# EAGLE schematic bc-module-base (EAGLE 7.7.0)
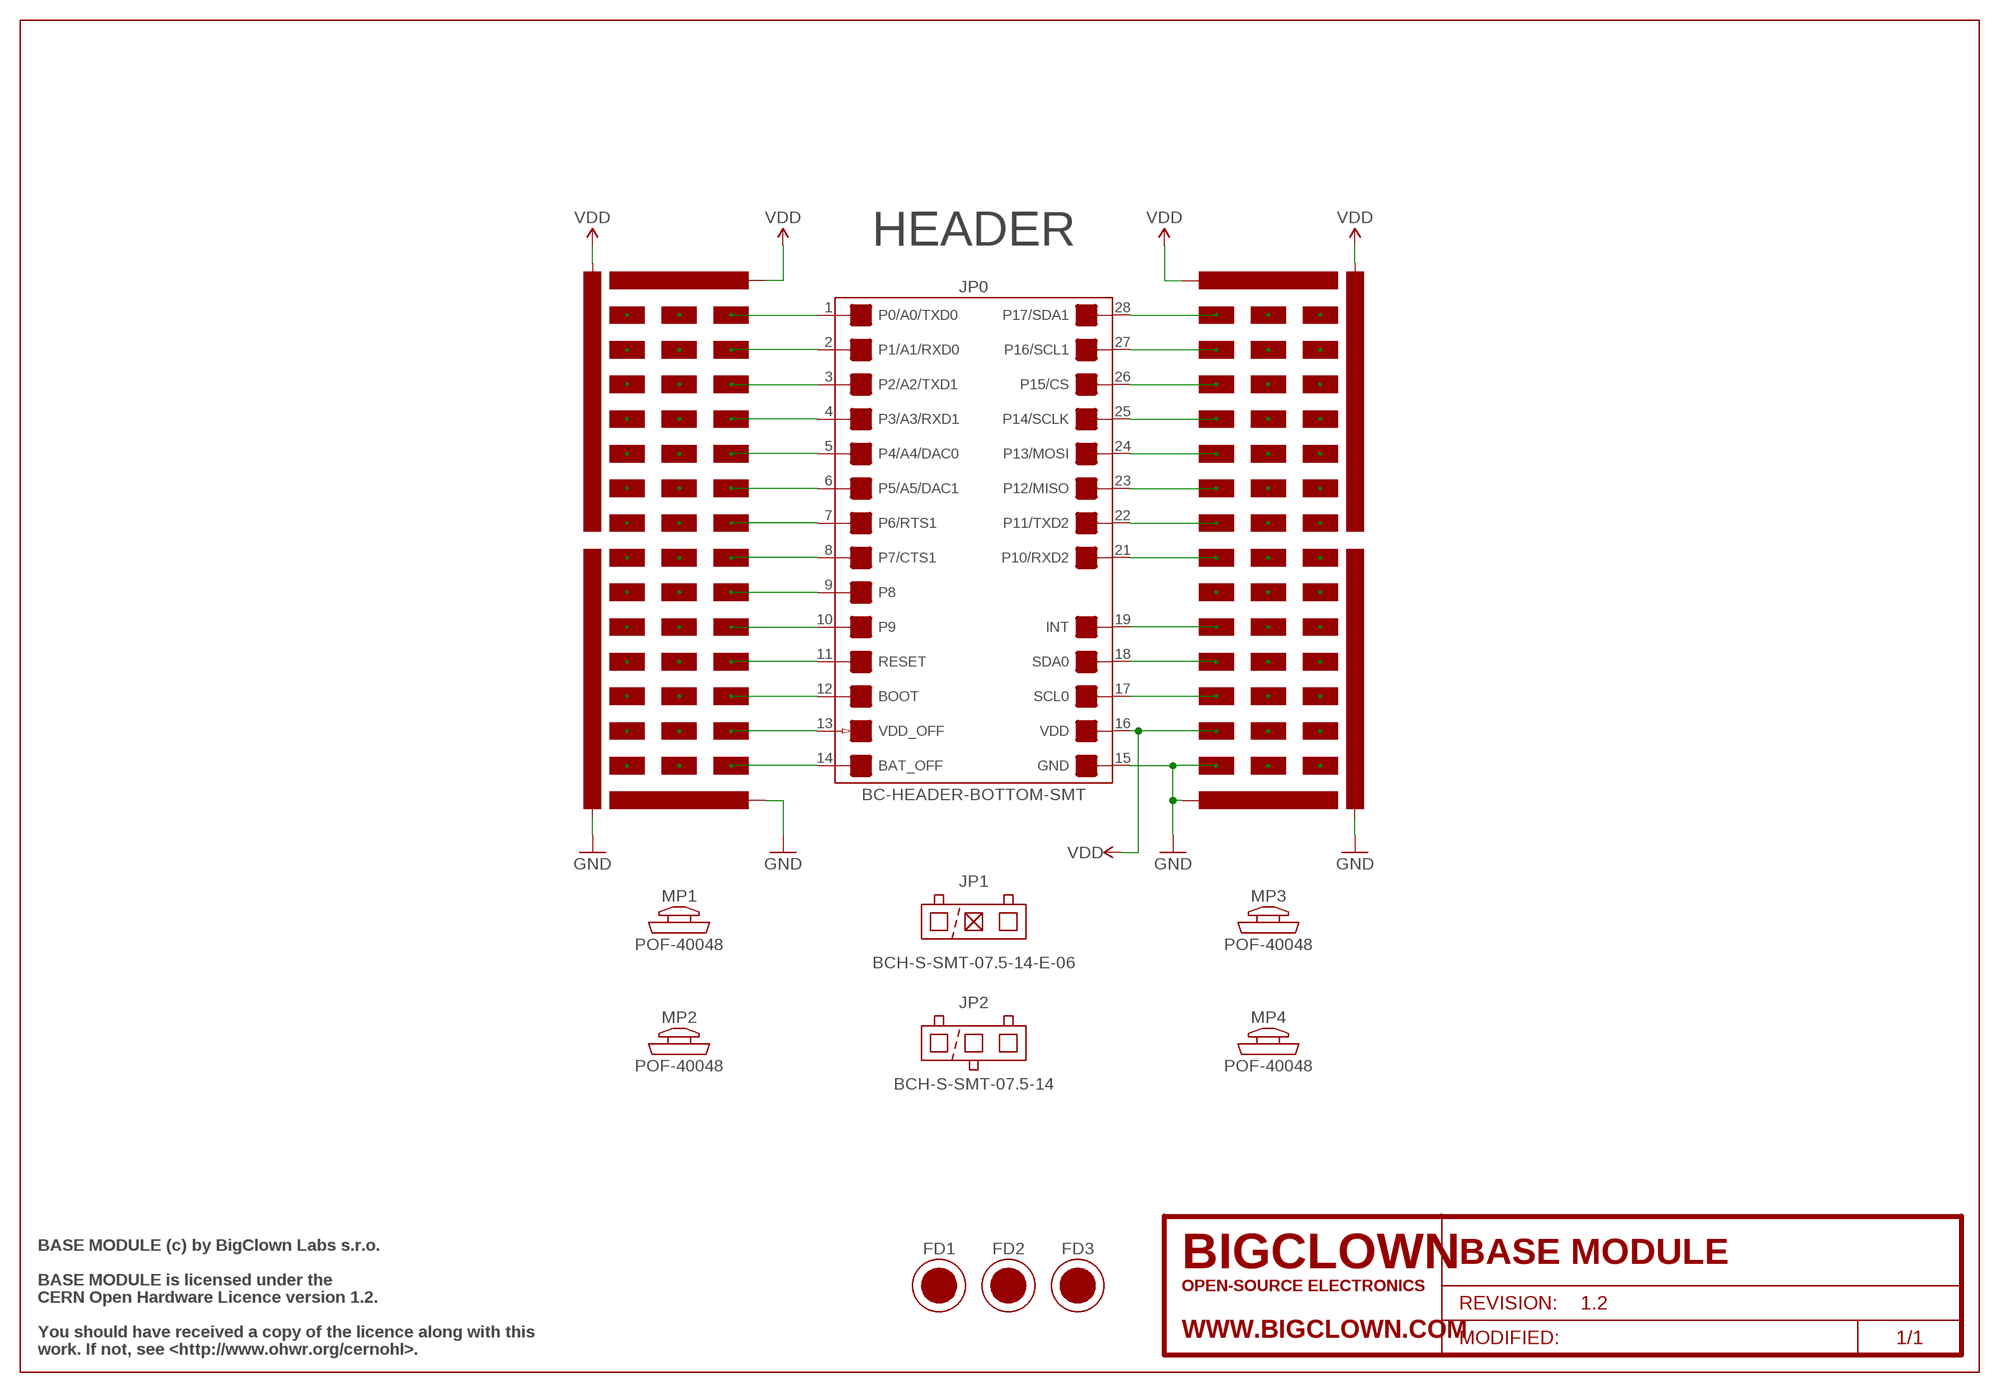
[diagram p0: schematic, sheet 1]

## Parts
FD1  FIDUCIAL  [FIDUCIAL-1MM]
FD2  FIDUCIAL  [FIDUCIAL-1MM]
FD3  FIDUCIAL  [FIDUCIAL-1MM]
FRAME1  FRAME-SCH/A4L-BRD/A4L  [FRAME-A4L]
JP0  BC-HEADER-BOTTOM-SMT  [BC-HEADER-BOTTOM-SMT]
JP1  BCH-S-SMT-07.5-14-E-06  JP-BCH-S-SMT-07.5-14-E-06  [BCH-S-SMT-14-E-06]
JP2  BCH-S-SMT-07.5-14  JP-BCH-S-SMT-07.5-14  [BCH-S-SMT-14]
JS1  PAD-SMD-1.6X14.30MM  [PAD-SMD-1.6X14.30MM]
JS1A  PAD-SMD-1.6X4.14MM  [PAD-SMD-1.6X4.14MM]
JS1B  PAD-SMD-1.6X4.14MM  [PAD-SMD-1.6X4.14MM]
JS1C  PAD-SMD-1.6X4.14MM  [PAD-SMD-1.6X4.14MM]
JS2  PAD-SMD-1.6X19.38  [PAD-SMD-1.6X19.38MM]
JS2A  PAD-SMD-1.6X4.14MM  [PAD-SMD-1.6X4.14MM]
JS2B  PAD-SMD-1.6X4.14MM  [PAD-SMD-1.6X4.14MM]
JS3  PAD-SMD-1.6X19.38  [PAD-SMD-1.6X19.38MM]
JS3A  PAD-SMD-1.6X4.14MM  [PAD-SMD-1.6X4.14MM]
JS3B  PAD-SMD-1.6X4.14MM  [PAD-SMD-1.6X4.14MM]
JS3C  PAD-SMD-1.6X4.14MM  [PAD-SMD-1.6X4.14MM]
JS4  PAD-SMD-1.6X14.30MM  [PAD-SMD-1.6X14.30MM]
JS4A  PAD-SMD-1.6X4.14MM  [PAD-SMD-1.6X4.14MM]
JS4B  PAD-SMD-1.6X4.14MM  [PAD-SMD-1.6X4.14MM]
JS4C  PAD-SMD-1.6X4.14MM  [PAD-SMD-1.6X4.14MM]
JS5  PAD-SMD-1.6X14.30MM  [PAD-SMD-1.6X14.30MM]
JS5C  PAD-SMD-1.6X4.14MM  [PAD-SMD-1.6X4.14MM]
JS5D  PAD-SMD-1.6X4.14MM  [PAD-SMD-1.6X4.14MM]
JS6  PAD-SMD-1.6X19.38  [PAD-SMD-1.6X19.38MM]
JS6A  PAD-SMD-1.6X4.14MM  [PAD-SMD-1.6X4.14MM]
JS6B  PAD-SMD-1.6X4.14MM  [PAD-SMD-1.6X4.14MM]
JS6C  PAD-SMD-1.6X4.14MM  [PAD-SMD-1.6X4.14MM]
JS7  PAD-SMD-1.6X19.38  [PAD-SMD-1.6X19.38MM]
JS7A  PAD-SMD-1.6X4.14MM  [PAD-SMD-1.6X4.14MM]
JS7B  PAD-SMD-1.6X4.14MM  [PAD-SMD-1.6X4.14MM]
JS7C  PAD-SMD-1.6X4.14MM  [PAD-SMD-1.6X4.14MM]
JS8  PAD-SMD-1.6X14.30MM  [PAD-SMD-1.6X14.30MM]
JS8A  PAD-SMD-1.6X4.14MM  [PAD-SMD-1.6X4.14MM]
JS8B  PAD-SMD-1.6X4.14MM  [PAD-SMD-1.6X4.14MM]
JS8C  PAD-SMD-1.6X4.14MM  [PAD-SMD-1.6X4.14MM]
JS8D  PAD-SMD-1.6X4.14MM  [PAD-SMD-1.6X4.14MM]
JS9A  PAD-SMD-1.6X4.14MM  [PAD-SMD-1.6X4.14MM]
JS9B  PAD-SMD-1.6X4.14MM  [PAD-SMD-1.6X4.14MM]
JS9C1  PAD-SMD-1.6X4.14MM  [PAD-SMD-1.6X4.14MM]
JS10B  PAD-SMD-1.6X4.14MM  [PAD-SMD-1.6X4.14MM]
JS10C  PAD-SMD-1.6X4.14MM  [PAD-SMD-1.6X4.14MM]
JS10D  PAD-SMD-1.6X4.14MM  [PAD-SMD-1.6X4.14MM]
JS11A  PAD-SMD-1.6X4.14MM  [PAD-SMD-1.6X4.14MM]
JS11B  PAD-SMD-1.6X4.14MM  [PAD-SMD-1.6X4.14MM]
JS11C  PAD-SMD-1.6X4.14MM  [PAD-SMD-1.6X4.14MM]
JS12A  PAD-SMD-1.6X4.14MM  [PAD-SMD-1.6X4.14MM]
JS12B  PAD-SMD-1.6X4.14MM  [PAD-SMD-1.6X4.14MM]
JS12C  PAD-SMD-1.6X4.14MM  [PAD-SMD-1.6X4.14MM]
JS13A  PAD-SMD-1.6X4.14MM  [PAD-SMD-1.6X4.14MM]
JS13B  PAD-SMD-1.6X4.14MM  [PAD-SMD-1.6X4.14MM]
JS13C  PAD-SMD-1.6X4.14MM  [PAD-SMD-1.6X4.14MM]
JS14A  PAD-SMD-1.6X4.14MM  [PAD-SMD-1.6X4.14MM]
JS14B  PAD-SMD-1.6X4.14MM  [PAD-SMD-1.6X4.14MM]
JS14C  PAD-SMD-1.6X4.14MM  [PAD-SMD-1.6X4.14MM]
JS15A  PAD-SMD-1.6X4.14MM  [PAD-SMD-1.6X4.14MM]
JS15B  PAD-SMD-1.6X4.14MM  [PAD-SMD-1.6X4.14MM]
JS15C  PAD-SMD-1.6X4.14MM  [PAD-SMD-1.6X4.14MM]
JS16A  PAD-SMD-1.6X4.14MM  [PAD-SMD-1.6X4.14MM]
JS16B  PAD-SMD-1.6X4.14MM  [PAD-SMD-1.6X4.14MM]
JS16C  PAD-SMD-1.6X4.14MM  [PAD-SMD-1.6X4.14MM]
JS17A  PAD-SMD-1.6X4.14MM  [PAD-SMD-1.6X4.14MM]
JS17B  PAD-SMD-1.6X4.14MM  [PAD-SMD-1.6X4.14MM]
JS17C  PAD-SMD-1.6X4.14MM  [PAD-SMD-1.6X4.14MM]
JS18A  PAD-SMD-1.6X4.14MM  [PAD-SMD-1.6X4.14MM]
JS18B  PAD-SMD-1.6X4.14MM  [PAD-SMD-1.6X4.14MM]
JS18C  PAD-SMD-1.6X4.14MM  [PAD-SMD-1.6X4.14MM]
JS19A  PAD-SMD-1.6X4.14MM  [PAD-SMD-1.6X4.14MM]
JS19B  PAD-SMD-1.6X4.14MM  [PAD-SMD-1.6X4.14MM]
JS19C  PAD-SMD-1.6X4.14MM  [PAD-SMD-1.6X4.14MM]
JS20A  PAD-SMD-1.6X4.14MM  [PAD-SMD-1.6X4.14MM]
JS20B  PAD-SMD-1.6X4.14MM  [PAD-SMD-1.6X4.14MM]
JS20C  PAD-SMD-1.6X4.14MM  [PAD-SMD-1.6X4.14MM]
JS21A  PAD-SMD-1.6X4.14MM  [PAD-SMD-1.6X4.14MM]
JS21B  PAD-SMD-1.6X4.14MM  [PAD-SMD-1.6X4.14MM]
JS21C  PAD-SMD-1.6X4.14MM  [PAD-SMD-1.6X4.14MM]
JS22A  PAD-SMD-1.6X4.14MM  [PAD-SMD-1.6X4.14MM]
JS22B  PAD-SMD-1.6X4.14MM  [PAD-SMD-1.6X4.14MM]
JS22C  PAD-SMD-1.6X4.14MM  [PAD-SMD-1.6X4.14MM]
JS23A  PAD-SMD-1.6X4.14MM  [PAD-SMD-1.6X4.14MM]
JS23B  PAD-SMD-1.6X4.14MM  [PAD-SMD-1.6X4.14MM]
JS23C  PAD-SMD-1.6X4.14MM  [PAD-SMD-1.6X4.14MM]
JS24A  PAD-SMD-1.6X4.14MM  [PAD-SMD-1.6X4.14MM]
JS24B  PAD-SMD-1.6X4.14MM  [PAD-SMD-1.6X4.14MM]
JS24C  PAD-SMD-1.6X4.14MM  [PAD-SMD-1.6X4.14MM]
JS25A  PAD-SMD-1.6X4.14MM  [PAD-SMD-1.6X4.14MM]
JS25B  PAD-SMD-1.6X4.14MM  [PAD-SMD-1.6X4.14MM]
JS25C  PAD-SMD-1.6X4.14MM  [PAD-SMD-1.6X4.14MM]
JS26A  PAD-SMD-1.6X4.14MM  [PAD-SMD-1.6X4.14MM]
JS26B  PAD-SMD-1.6X4.14MM  [PAD-SMD-1.6X4.14MM]
JS26C  PAD-SMD-1.6X4.14MM  [PAD-SMD-1.6X4.14MM]
JS27A  PAD-SMD-1.6X4.14MM  [PAD-SMD-1.6X4.14MM]
JS27B  PAD-SMD-1.6X4.14MM  [PAD-SMD-1.6X4.14MM]
JS27C  PAD-SMD-1.6X4.14MM  [PAD-SMD-1.6X4.14MM]
JS28A  PAD-SMD-1.6X4.14MM  [PAD-SMD-1.6X4.14MM]
JS28B  PAD-SMD-1.6X4.14MM  [PAD-SMD-1.6X4.14MM]
JS28C  PAD-SMD-1.6X4.14MM  [PAD-SMD-1.6X4.14MM]
JSS2  PAD-SMD-1.6X4.14MM  [PAD-SMD-1.6X4.14MM]
MP1  POF-40048  MP-POF-40048  [POF-40048]
MP2  POF-40048  MP-POF-40048  [POF-40048]
MP3  POF-40048  MP-POF-40048  [POF-40048]
MP4  POF-40048  MP-POF-40048  [POF-40048]

## Nets
BAT_OFF: JP0.14(BAT_OFF) JS14A.0
BOOT: JP0.12(BOOT) JS12A.0
GND: JP0.15(GND) JS3.0 JS4.0 JS5.0 JS6.0 JS15A.0
N$2: JP0.19(INT) JS19A.0
N$3: JP0.18(SDA0) JS18A.0
N$4: JP0.17(SCL0) JS17A.0
P0/A0/TXD0: JP0.1(P0/A0/TXD0) JS1A.0
P1/A1/RXD0: JP0.2(P1/A1/RXD0) JS2A.0
P2/A2/TXD1: JP0.3(P2/A2/TXD1) JS3A.0
P3/A3/RXD1: JP0.4(P3/A3/RXD1) JS4A.0
P4/A4/DAC0: JP0.5(P4/A4/DAC0) JS5D.0
P5/A5/DAC1: JP0.6(P5/A5/DAC1) JS6A.0
P6/RTS1: JP0.7(P6/RTS1) JS7A.0
P7/CTS1: JP0.8(P7/CTS1) JS8A.0
P8: JP0.9(P8) JS9A.0
P9: JP0.10(P9) JS10D.0
P10/RXD2: JP0.21(P10/RXD2) JS21A.0
P11/TXD2: JP0.22(P11/TXD2) JS22A.0
P12/MISO: JP0.23(P12/MISO) JS23A.0
P13/MOSI: JP0.24(P13/MOSI) JS24A.0
P14/SCLK: JP0.25(P14/SCLK) JS25A.0
P15/CS: JP0.26(P15/CS) JS26A.0
P16/SCL1: JP0.27(P16/SCL1) JS27A.0
P17/SDA1: JP0.28(P17/SDA1) JS28A.0
RESET: JP0.11(RESET) JS11A.0
VDD: JP0.16(VDD) JS1.0 JS2.0 JS7.0 JS8.0 JS16A.0
VDD_OFF: JP0.13(VDD_OFF_IN) JS13A.0
Unconnected: JS1B.0 JS1C.0 JS2B.0 JS3B.0 JS3C.0 JS4B.0 JS4C.0 JS5C.0 JS6B.0 JS6C.0 JS7B.0 JS7C.0 JS8B.0 JS8C.0 JS8D.0 JS9B.0 JS9C1.0 JS10B.0 JS10C.0 JS11B.0 JS11C.0 JS12B.0 JS12C.0 JS13B.0 JS13C.0 JS14B.0 JS14C.0 JS15B.0 JS15C.0 JS16B.0 JS16C.0 JS17B.0 JS17C.0 JS18B.0 JS18C.0 JS19B.0 JS19C.0 JS20A.0 JS20B.0 JS20C.0 JS21B.0 JS21C.0 JS22B.0 JS22C.0 JS23B.0 JS23C.0 JS24B.0 JS24C.0 JS25B.0 JS25C.0 JS26B.0 JS26C.0 JS27B.0 JS27C.0 JS28B.0 JS28C.0 JSS2.0

## Notes on the sheet
- HEADER
- BASE MODULE (c) by BigClown Labs s.r.o.
- BASE MODULE is licensed under the
- CERN Open Hardware Licence version 1.2.
- You should have received a copy of the licence along with this
- work. If not, see <http://www.ohwr.org/cernohl>.

## Library data of the parts
FD1-FD3 = bc-fiducial:FIDUCIAL; BCPN: -
FRAME1 = bc-frame:FRAME-SCH/A4L-BRD/A4L; BCPN: -; PROJECT_NAME: BASE MODULE; PROJECT_REVISION: 1.2
JP0 = bc-header:BC-HEADER-BOTTOM-SMT; BCPN: -
JP1 = bc-header:JP-BCH-S-SMT-07.5-14-E-06; BCPN: BC-JP-BCH-S-SMT-07.5-14-E-06
JP2 = bc-header:JP-BCH-S-SMT-07.5-14; BCPN: BC-JP-BCH-S-SMT-07.5-14
JS1 JS4 JS5 JS8 = bc-prototype:PAD-SMD-1.6X14.30MM; BCPN: -
JS1A JS1B JS1C JS2A JS2B JS3A JS3B JS3C JS4A JS4B JS4C JS5C JS5D JS6A JS6B JS6C JS7A JS7B JS7C JS8A JS8B JS8C JS8D JS9A JS9B JS9C1 JS10B JS10C JS10D JS11A JS11B JS11C JS12A JS12B JS12C JS13A JS13B JS13C JS14A JS14B JS14C JS15A JS15B JS15C JS16A JS16B JS16C JS17A JS17B JS17C JS18A JS18B JS18C JS19A JS19B JS19C JS20A JS20B JS20C JS21A JS21B JS21C JS22A JS22B JS22C JS23A JS23B JS23C JS24A JS24B JS24C JS25A JS25B JS25C JS26A JS26B JS26C JS27A JS27B JS27C JS28A JS28B JS28C JSS2 = bc-prototype:PAD-SMD-1.6X4.14MM; BCPN: -
JS2 JS3 JS6 JS7 = bc-prototype:PAD-SMD-1.6X19.38; BCPN: -
MP1-MP4 = bc-mechanical:MP-POF-40048; BCPN: BC-MP-POF-40048